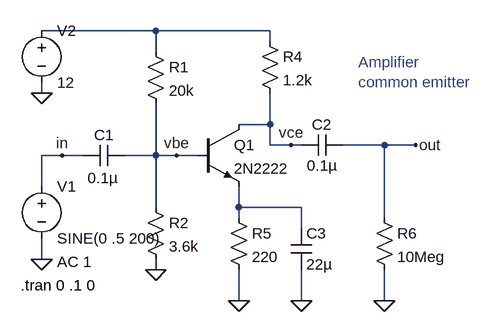
[diagram p0: schematic lab05b-Trans-amp-ce.asc]
lab05b-Trans-amp-ce.asc, the LTspice schematic file:
Version 4
SHEET 1 880 680
WIRE 160 -16 -16 -16
WIRE 336 -16 160 -16
WIRE 336 0 336 -16
WIRE 160 16 160 -16
WIRE -16 80 -16 64
WIRE 336 128 336 80
WIRE 336 128 288 128
WIRE 336 160 336 128
WIRE 368 160 336 160
WIRE 384 160 368 160
WIRE 512 160 448 160
WIRE 560 160 512 160
WIRE 16 176 -16 176
WIRE 48 176 16 176
WIRE 160 176 160 96
WIRE 160 176 112 176
WIRE 192 176 160 176
WIRE 224 176 192 176
WIRE -16 224 -16 176
WIRE 160 256 160 176
WIRE 288 256 288 224
WIRE 384 256 288 256
WIRE 288 272 288 256
WIRE 512 272 512 160
WIRE 384 288 384 256
WIRE -16 336 -16 304
WIRE 160 352 160 336
WIRE 288 400 288 352
WIRE 384 400 384 352
WIRE 512 400 512 352
FLAG 160 352 0
FLAG -16 336 0
FLAG -16 80 0
FLAG 16 176 in
FLAG 288 400 0
FLAG 192 176 vbe
FLAG 368 160 vce
FLAG 560 160 out
FLAG 384 400 0
FLAG 512 400 0
SYMBOL voltage -16 208 R0
WINDOW 123 24 132 Left 0
WINDOW 39 0 0 Left 0
SYMATTR Value2 AC 1
SYMATTR InstName V1
SYMATTR Value SINE(0 .5 200)
SYMBOL cap 112 160 R90
WINDOW 0 0 32 VBottom 0
WINDOW 3 35 33 VTop 0
SYMATTR InstName C1
SYMATTR Value 0.1µ
SYMBOL res 144 0 R0
SYMATTR InstName R1
SYMATTR Value 20k
SYMBOL res 144 240 R0
SYMATTR InstName R2
SYMATTR Value 3.6k
SYMBOL res 320 -16 R0
SYMATTR InstName R4
SYMATTR Value 1.2k
SYMBOL cap 448 144 R90
WINDOW 0 0 32 VBottom 0
WINDOW 3 32 32 VTop 0
SYMATTR InstName C2
SYMATTR Value 0.1µ
SYMBOL voltage -16 -32 R0
WINDOW 123 0 0 Left 0
WINDOW 39 0 0 Left 0
SYMATTR InstName V2
SYMATTR Value 12
SYMBOL npn 224 128 R0
SYMATTR InstName Q1
SYMATTR Value 2N2222
SYMBOL cap 368 288 R0
SYMATTR InstName C3
SYMATTR Value 22µ
SYMBOL res 272 256 R0
SYMATTR InstName R5
SYMATTR Value 220
SYMBOL res 496 256 R0
SYMATTR InstName R6
SYMATTR Value 10Meg
TEXT -48 376 Left 0 !.tran 0 .1 0
TEXT 472 32 Left 0 ;Amplifier \ncommon emitter

The netlist it stands for:
* lab05b-Trans-amp-ce.asc
V1 in 0 SINE(0 .5 200) AC 1
C1 vbe in 0.1µ
R1 N001 vbe 20k
R2 vbe 0 3.6k
R4 N001 vce 1.2k
C2 out vce 0.1µ
V2 N001 0 12
Q1 vce vbe N002 0 2N2222
C3 N002 0 22µ
R5 N002 0 220
R6 out 0 10Meg
.model NPN NPN
.model PNP PNP
.lib standard.bjt
.tran 0 .1 0
* Amplifier
* common emitter
.backanno
.end